# EAGLE design dwm1000_breakout (EAGLE 9.6.2)
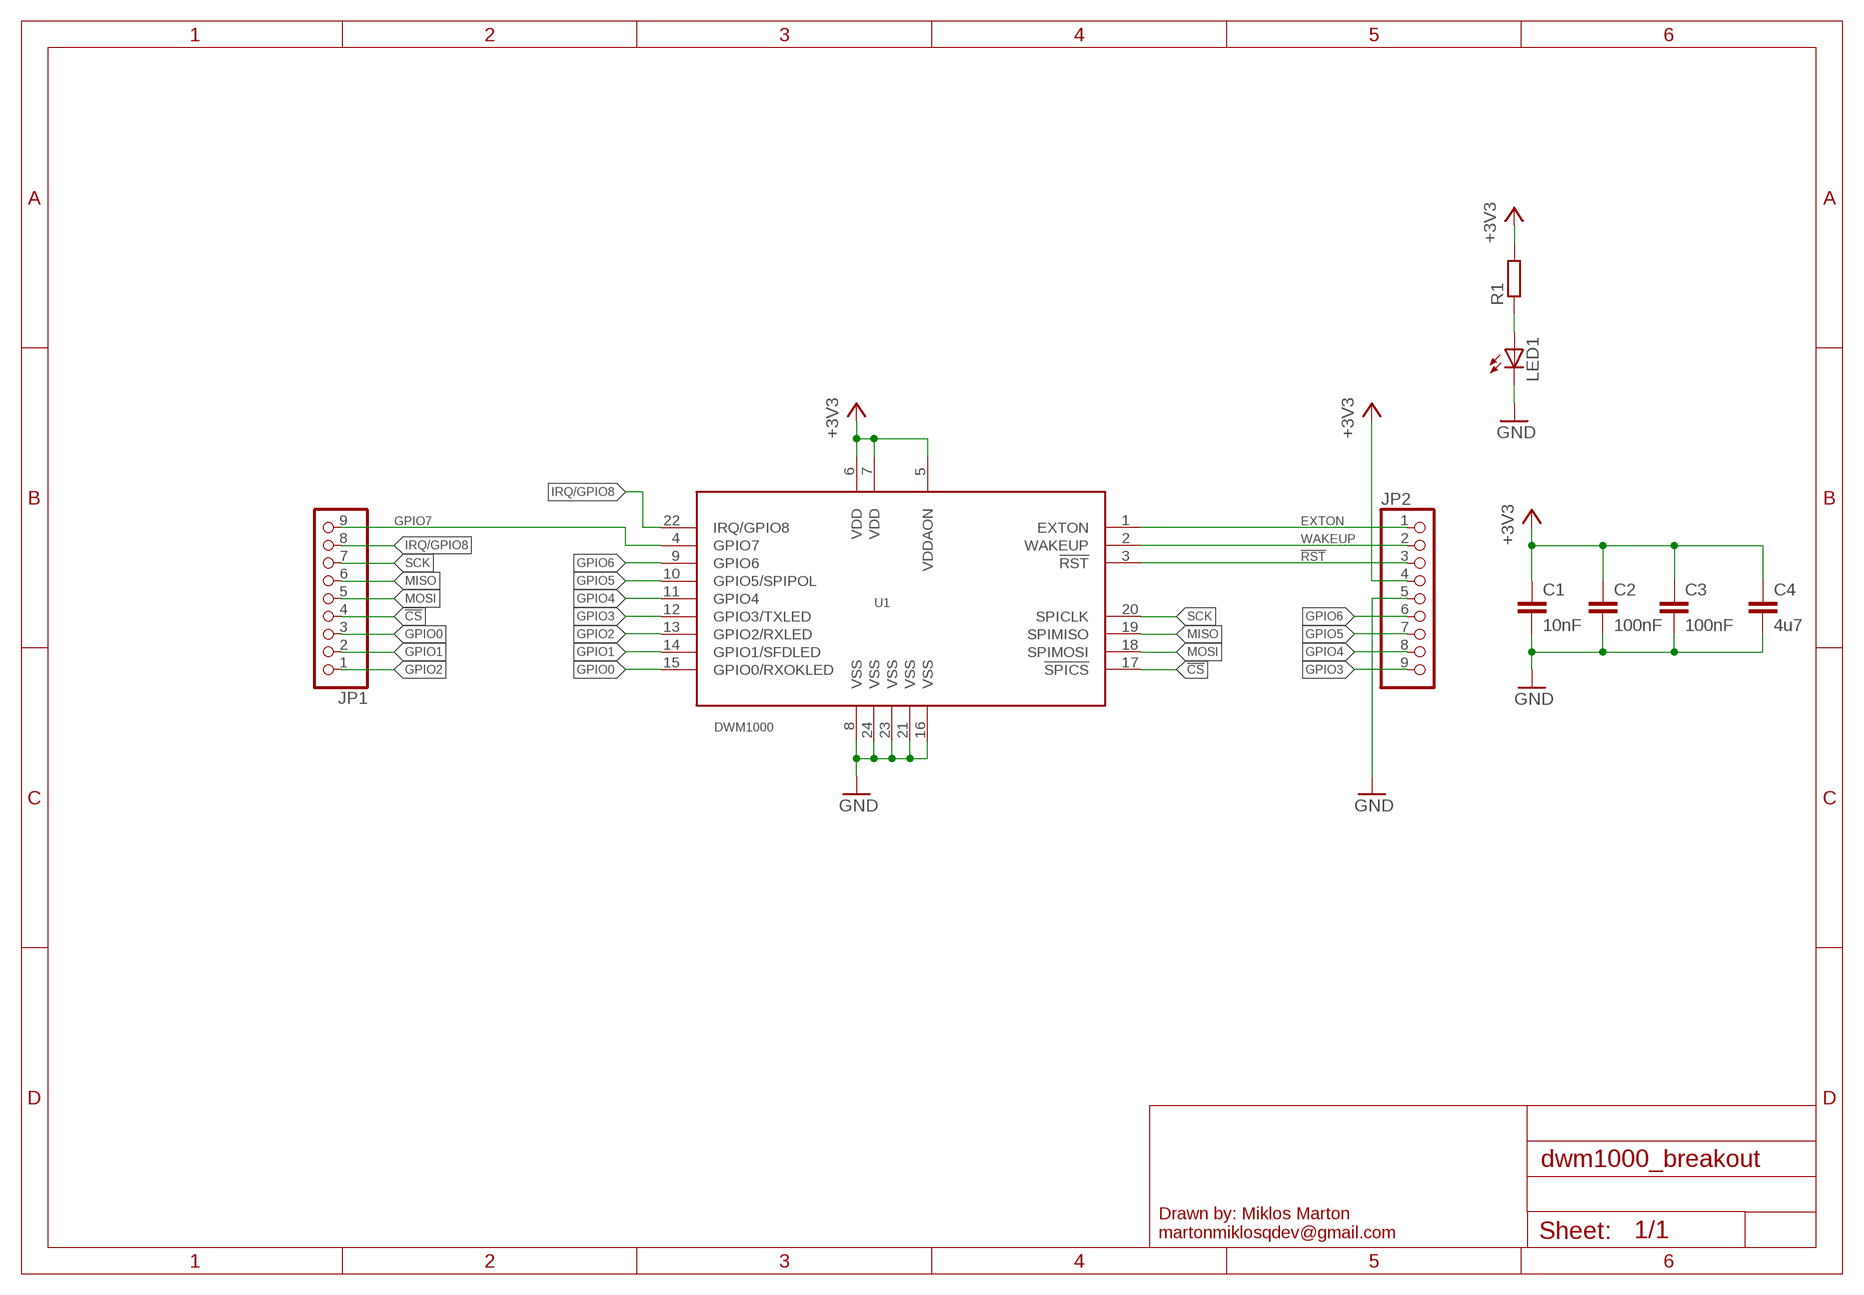
[diagram p0: schematic, sheet 1]

## Parts
C1  10nF  C-EUC0603  [C0603]
C2  100nF  C-EUC0603  [C0603]
C3  100nF  C-EUC0603  [C0603]
C4  4u7  C-EUC0805K  [C0805K]
JP1  PINHD-1X9  [1X09]
JP2  PINHD-1X9  [1X09]
LED1  LEDCHIP-LED0603  [CHIP-LED0603]
R1  R-EU_R0603  [R0603]
U1  DWM1000  [DWM1000]

## Nets
!CS: JP1.4 U1.17(!SPICS)
!RST: JP2.3 U1.3(!RST)
+3V3: C1.1 C2.1 C3.1 C4.1 JP2.4 R1.2 U1.5(VDDAON) U1.6(VDD) U1.7(VDD)
EXTON: JP2.1 U1.1(EXTON)
GND: C1.2 C2.2 C3.2 C4.2 JP2.5 LED1.C U1.8(VSS) U1.16(VSS) U1.21(VSS) U1.23(VSS) U1.24(VSS)
GPIO0: JP1.3 U1.15(GPIO0/RXOKLED)
GPIO1: JP1.2 U1.14(GPIO1/SFDLED)
GPIO2: JP1.1 U1.13(GPIO2/RXLED)
GPIO3: JP2.9 U1.12(GPIO3/TXLED)
GPIO4: JP2.8 U1.11(GPIO4)
GPIO5: JP2.7 U1.10(GPIO5/SPIPOL)
GPIO6: JP2.6 U1.9(GPIO6)
GPIO7: JP1.9 U1.4(GPIO7)
IRQ/GPIO8: JP1.8 U1.22(IRQ/GPIO8)
MISO: JP1.6 U1.19(SPIMISO)
MOSI: JP1.5 U1.18(SPIMOSI)
N$17: LED1.A R1.1
SCK: JP1.7 U1.20(SPICLK)
WAKEUP: JP2.2 U1.2(WAKEUP)

## Library data of the parts
C1-C4 = rcl:C-EU: CAPACITOR, European symbol
JP1 JP2 = pinhead:PINHD-1X9: PIN HEADER
LED1 = led:LED: LED OSRAM: - CHIPLED LG R971, LG N971, LY N971, LG Q971, LY Q971, LO R971, LY R971 LH N974, LH R974 LS Q976, LO Q976, LY Q976 LO Q996 - Hyper CHIPLED LW Q18S LB Q993, LB Q99A, LB R99A - SideLED LS A670, LO A670, LY A670, LG A670, LP A670 LB A673, LV A673, LT A673, LW A673 LH A674 LY A675 LS A676, LA A676, LO A676, LY A676, LW A676 LS A679, LY A679, LG A679 - Hyper Micro SIDELED® LS Y876, LA Y876, LO Y876, LY Y876 LT Y87S - SmartLED LW L88C, LW L88S LB L89C, LB L89S, LG L890 LS L89K, LO L89K, LY L89K LS L896, LA L896, LO L896, LY L896 - TOPLED LS T670, LO T670, LY T670, LG T670, LP T670 LSG T670, LSP T670, LSY T670, LOP T670, LYG T670 LG T671, LOG T671, LSG T671 LB T673, LV T673, LT T673, LW T673 LH T674 LS T676, LA T676, LO T676, LY T676, LB T676, LH T676, LSB T676, LW T676 LB T67C, LV T67C, LT T67C, LS T67K, LO T67K, LY T67K, LW E67C LS E67B, LA E67B, LO E67B, LY E67B, LB E67C, LV E67C, LT E67C LW T67C LS T679, LY T679, LG T679 LS T770, LO T770, LY T770, LG T770, LP T770 LB T773, LV T773, LT T773, LW T773 LH T774 LS E675, LA E675, LY E675, LS T675 LS T776, LA T776, LO T776, LY T776, LB T776 LHGB T686 LT T68C, LB T68C - Hyper Mini TOPLED® LB M676 - Mini TOPLED Santana® LG M470 LS M47K, LO M47K, LY M47K Source: http://www.osram.convergy.de LUXEON: - LUMILED® LXK2-PW12-R00, LXK2-PW12-S00, LXK2-PW14-U00, LXK2-PW14-V00 LXK2-PM12-R00, LXK2-PM12-S00, LXK2-PM14-U00 LXK2-PE12-Q00, LXK2-PE12-R00, LXK2-PE12-S00, LXK2-PE14-T00, LXK2-PE14-U00 LXK2-PB12-K00, LXK2-PB12-L00, LXK2-PB12-M00, LXK2-PB14-N00, LXK2-PB14-P00, LXK2-PB14-Q00 LXK2-PR12-L00, LXK2-PR12-M00, LXK2-PR14-Q00, LXK2-PR14-R00 LXK2-PD12-Q00, LXK2-PD12-R00, LXK2-PD12-S00 LXK2-PH12-R00, LXK2-PH12-S00 LXK2-PL12-P00, LXK2-PL12-Q00, LXK2-PL12-R00 Source: www.luxeon.com KINGBRIGHT: KA-3528ASYC Source: www.kingbright.com
R1 = rcl:R-EU_: RESISTOR, European symbol
U1 = DWM1000:DWM1000: The DWM1000 module is based on Decawave's DW1000 Ultra Wideband (UWB) transceiver IC. It integrates antenna, all RF circuitry, power management and clock circuitry in one module. It can be used in 2-way ranging or TDOA location systems to locate assets to a precision of 10 cm and supports data rates of up to 6.8 Mbps

## Board
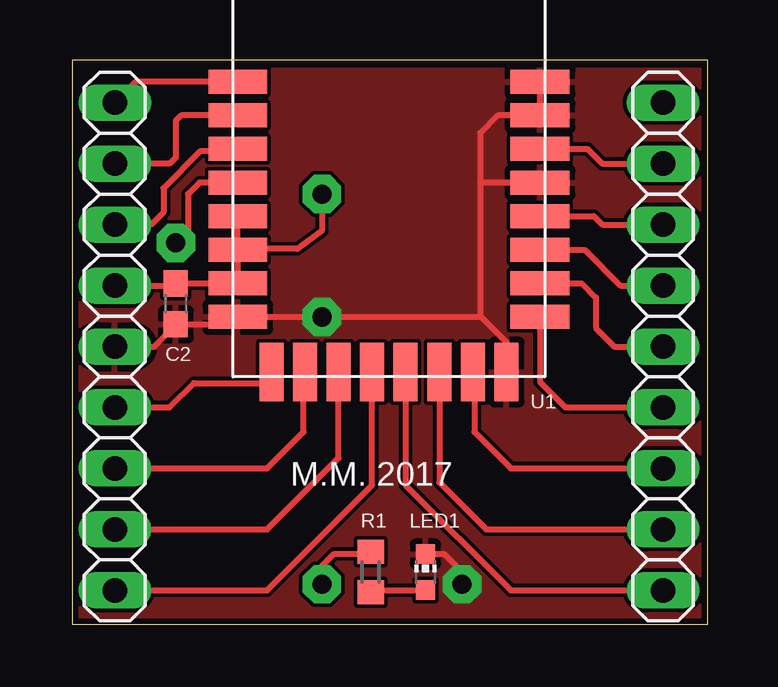
[diagram p1: board, top side]
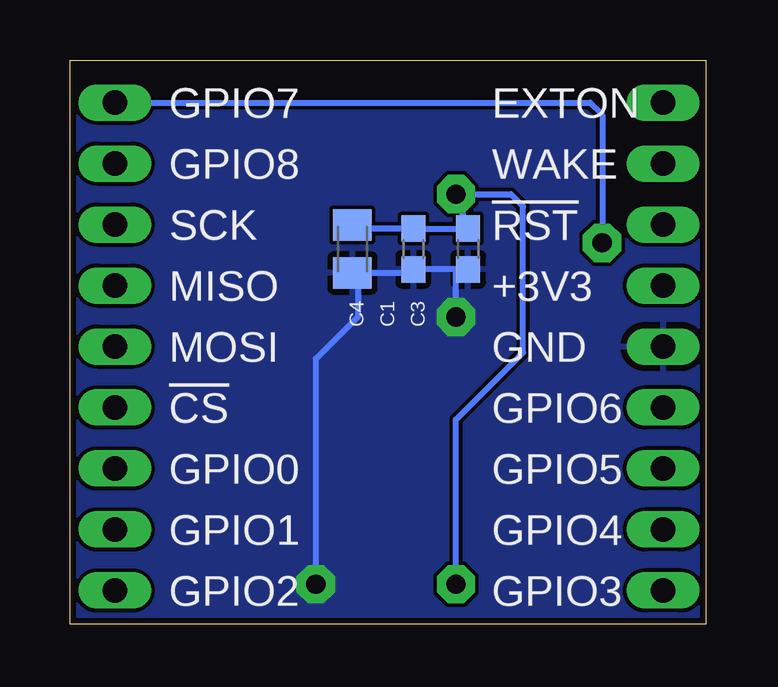
[diagram p2: board, bottom side, seen from below]

Size 26.5 x 23.51 mm. Coordinates in mm from the lower left corner, seen from the top.
Outline: 0,23.51 0,0 26.5,0 26.5,23.51 0,23.51
Copper layers (1*16): Top 0.035mm / dielectric 1.5mm / Bottom 0.035mm
Design rules "dirt_cheap_dirty_boards.v1": minimum track width 5mil, minimum drill 0.3mm, track to track 6mil, track to pad 6mil, pad to pad 6mil, via to via 6mil, smd to smd 0mil, copper to edge 10mil, drill to drill 10mil, minimum pad ring 10mil, minimum via ring 6mil, stop-mask expansion 2mil, vias tented up to drill 25mil, thermal gap 10mil

### Footprints (pad centres in the part's own frame; a part is rotated, then mirrored left to right if it is on the bottom)
C0603 = smd 1.1 x 1: 1 -0.85,0; 2 0.85,0
C0805K = smd 1.3 x 1.6: 1 -1,0; 2 1,0
1X09 = drill 1.016 long: 1 -10.16,0; 2 -7.62,0; 3 -5.08,0; 4 -2.54,0; 5 0,0; 6 2.54,0; 7 5.08,0; 8 7.62,0; 9 10.16,0
CHIP-LED0603 = smd 0.8 x 0.8: A 0,-0.75; C 0,0.75
R0603 = smd 1 x 1.1: 1 -0.85,0; 2 0.85,0
DWM1000 = smd 2.45 x 1: 1 -6.3,12.3; 2 -6.3,10.9; 3 -6.3,9.5; 4 -6.3,8.1; 5 -6.3,6.7; 6 -6.3,5.3; 7 -6.3,3.9; 8 -6.3,2.5; 17 6.3,2.5; 18 6.3,3.9; 19 6.3,5.3; 20 6.3,6.7; 21 6.3,8.1; 22 6.3,9.5; 23 6.3,10.9; 24 6.3,12.3 | smd 1 x 2.45: 9 -4.9,0.205; 10 -3.5,0.205; 11 -2.1,0.205; 12 -0.7,0.205; 13 0.7,0.205; 14 2.1,0.205; 15 3.5,0.205; 16 4.9,0.205

### Placement (x,y rotation side)
C1  12.19,15.63 270 bottom
C2  4.32,13.35 270 top
C3  9.91,15.63 270 bottom
C4  14.73,15.63 270 bottom
JP1  24.64,11.57 90 top
JP2  1.78,11.57 270 top
LED1  14.73,2.17 0 top
R1  12.45,2.17 90 top
U1  13.21,10.3 0 top

### Tracks (layer width: path | path; a pad name or v marks a point on that pad's centre or on a via)
!CS
  Top 0.254: U1.17 19.51,10.1 20.57,9.03 JP1.4
!RST
  Top 0.254: U1.3 6.81,19.7 5.33,19.7 3.81,18.17 3.81,17.16 3.3,16.65 JP2.3
+3V3  (via drill 0.8 pad 1.6)
  Top 0.254: U1.6 U1.7 C2.1 4.23,14.11 JP2.4 | U1.6 U1.5 | v10.41,17.92 10.41,16.4 9.4,15.63 6.94,15.63 U1.6 | R1.2 12.36,2.93 10.92,2.93 10.41,2.43 v10.41,1.66
  Bottom 0.254: C4.1 14.58,16.48 C1.1 C3.1 v10.41,17.92 8.13,17.92 7.62,17.41 7.62,11.32 10.41,8.52 v10.41,1.66
EXTON
  Top 0.254: U1.1 2.65,22.6 JP2.1
GND  (via drill 0.8 pad 1.6)
  Top 0.254: U1.24 U1.23 17.76,21.2 17.02,20.46 17.02,18.4 | U1.21 17.02,18.4 | 17.02,12.84 16.98,12.8 v10.41,12.8 U1.8 6.61,12.5 C2.2 3.39,11.57 JP2.5 | LED1.C 14.74,2.93 15.49,2.93 16,2.43 16,1.66 v16.26,1.66 | 17.02,18.4 17.02,12.84 | U1.16 18.11,11.75 17.02,12.84
  Bottom 0.254: v10.41,12.8 10.41,14.73 9.91,14.73 C3.2 C1.2 12.34,14.63 C4.2 14.48,14.38 14.48,12.84 16.26,11.06 v16.26,1.66
  pour Top: 26.42,23.51 0,23.51 0,0.14 26.42,0.14
  pour Bottom: 26.42,23.51 0,23.51 0,0.14 26.42,0.14
GPIO0
  Top 0.254: U1.15 16.76,10.45 16.76,8.01 18.29,6.49 JP1.3
GPIO1
  Top 0.254: U1.14 15.31,5.91 17.27,3.95 JP1.2
GPIO2
  Top 0.254: U1.13 13.91,5.79 18.29,1.41 JP1.1
GPIO3
  Top 0.254: JP2.9 8.13,1.41 12.51,5.79 U1.12
GPIO4
  Top 0.254: JP2.8 8.13,3.95 11.11,6.93 U1.11
GPIO5
  Top 0.254: JP2.7 8.13,6.49 9.65,8.01 9.65,10.45 U1.10
GPIO6
  Top 0.254: JP2.6 4.06,9.03 5.08,10.05 7.85,10.05 U1.9
GPIO7  (via drill 0.8 pad 1.6)
  Top 0.254: U1.4 5.31,18.4 4.83,17.92 4.83,16.4 v4.32,15.89
  Bottom 0.254: JP1.9 4.83,21.73 4.32,21.22 v4.32,15.89
IRQ/GPIO8
  Top 0.254: U1.22 21.49,19.8 22.1,19.19 JP1.8
MISO
  Top 0.254: U1.19 21.37,15.6 22.86,14.11 JP1.6
MOSI
  Top 0.254: U1.18 21.25,14.2 21.84,13.6 21.84,12.33 22.61,11.57 JP1.5
N$17
  Top 0.254: R1.1 12.55,1.42 LED1.A
SCK
  Top 0.254: U1.20 21.75,17 22.1,16.65 JP1.7
WAKEUP
  Top 0.254: JP2.2 4.06,19.19 4.32,19.44 4.32,20.97 4.55,21.2 U1.2

### Text on the board
tPlace: M.M. 2017
bPlace: EXTON / WAKE / !RST / +3V3 / GND / GPIO6 / GPIO5 / GPIO4 / GPIO3 | GPIO7 / GPIO8 / SCK / MISO / MOSI / !CS / GPIO0 / GPIO1 / GPIO2
_bNames: C4 | C3 | C1